# EAGLE design opamp (EAGLE 9.2.2)
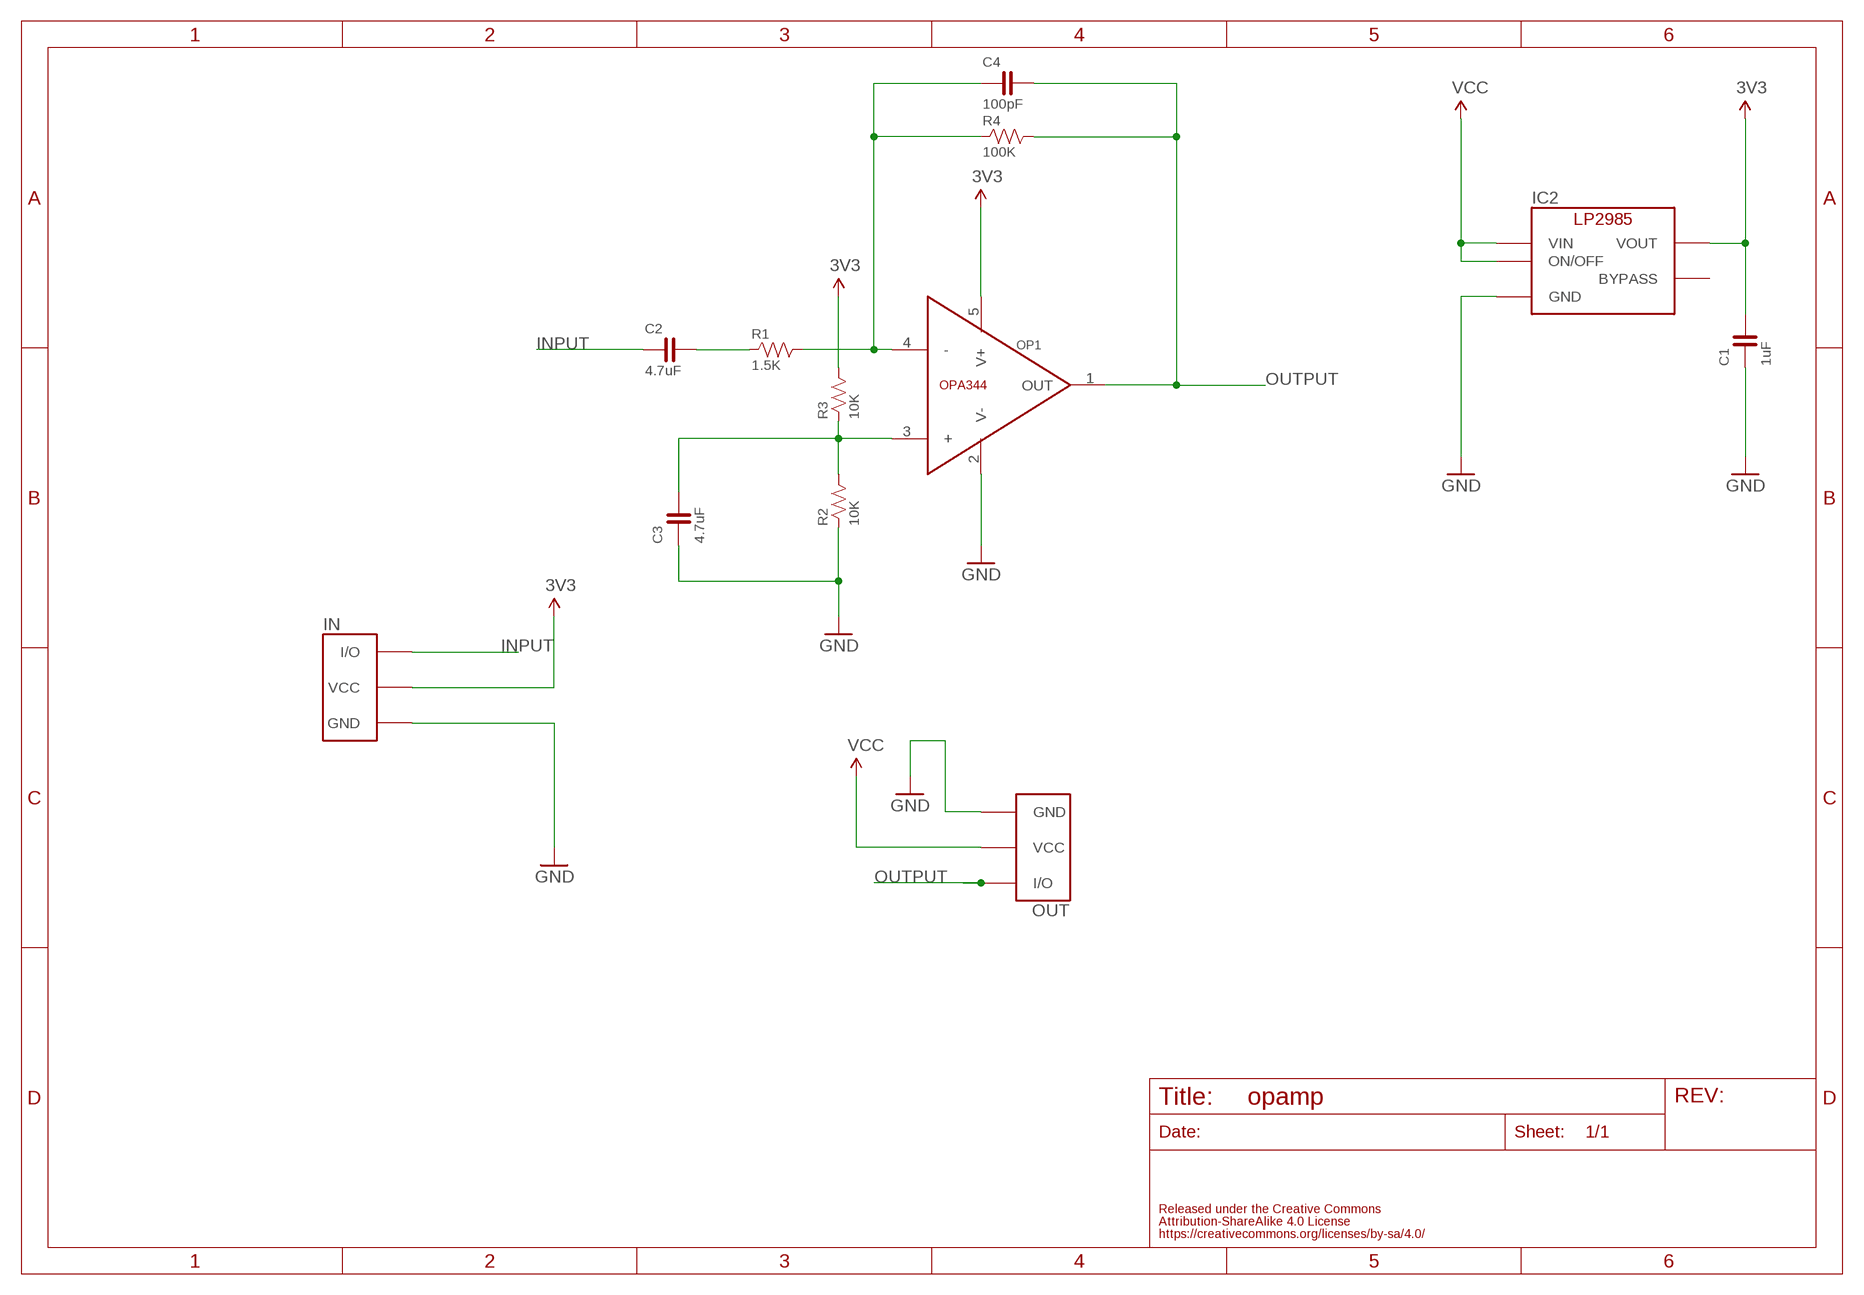
[diagram p0: schematic, sheet 1]

## Parts
C1  1uF  CAPACITOR-0603  [0603]
C2  4.7uF  CAPACITOR-0603  [0603]
C3  4.7uF  CAPACITOR-0603  [0603]
C4  100pF  CAPACITOR-0603  [0603]
IC2  LP2985-33DBV  [SOT-23-5]
IN  FABO_BRICK_3PIN-S03B-PASK-2  [FABO_BRICK_3PIN_S03B-PASK-2]
OP1  OPA344  [SOT23-5]
OUT  FABO_BRICK_3PIN-S03B-PASK-2  [FABO_BRICK_3PIN_S03B-PASK-2]
R1  1.5K  RESISTOR-0603  [0603]
R2  10K  RESISTOR-0603  [0603]
R3  10K  RESISTOR-0603  [0603]
R4  100K  RESISTOR-0603  [0603]

## Nets
3V3: C1.2 IC2.5(VOUT) IN.VCC OP1.5(V+) R3.2
GND: C1.1 C3.1 IC2.2(GND) IN.GND OP1.2(V-) OUT.GND R2.1
INPUT: C2.1 IN.I/O
N$1: C2.2 R1.1
N$3: C3.2 OP1.3(+) R2.2 R3.1
N$5: C4.1 OP1.4(-) R1.2 R4.1
OUTPUT: C4.2 OP1.1(OUT) OUT.I/O R4.2
VCC: IC2.1(VIN) IC2.3(ON/OFF) OUT.VCC
Unconnected: IC2.4(BYPASS)

## Library data of the parts
C1-C4 = FaBo-Capacitor:CAPACITOR: CAPACITOR
IC2 = FaBo-Supply:LP2985: LP2985
IN OUT = FaBo-Template:FABO_BRICK_3PIN: FaBo Brick 3pin
OP1 = FaBo-Opamp:OPA344
R1-R4 = FaBo-Resistors:RESISTOR: RESISTOR

## Board
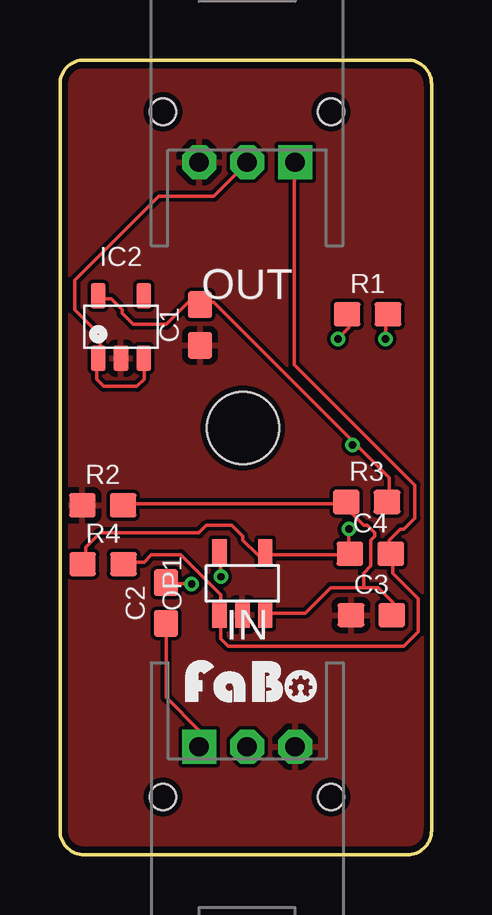
[diagram p1: board, top side]
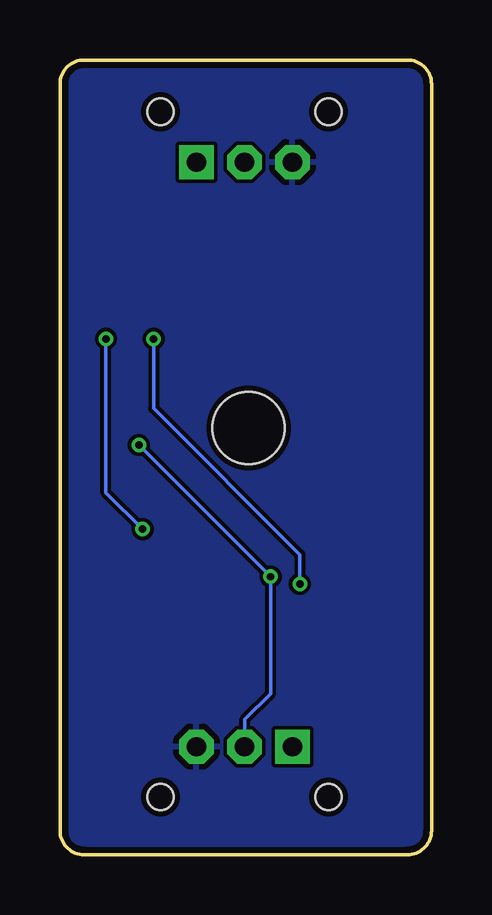
[diagram p2: board, bottom side, seen from below]

Size 15.48 x 33.11 mm. Coordinates in mm from the lower left corner, seen from the top.
Outline: 15.48,32.11 15.48,1 arc-90 14.48,0 1,0 arc-90 0,1 0,32.11 arc-90 1,33.11 14.48,33.11 arc-90 15.48,32.11
Copper layers (1*16): Top 0.035mm / dielectric 1.5mm / Bottom 0.035mm
Design rules "SeeedStudio_2layer_DRU_no_angle_20140221": minimum track width 6mil, minimum drill 12mil, track to track 6mil, track to pad 6mil, pad to pad 6mil, via to via 6mil, smd to smd 0mil, copper to edge 10mil, drill to drill 10mil, minimum pad ring 10mil, minimum via ring 6mil, stop-mask expansion 2mil, vias tented up to drill 100mil, thermal gap 10mil
Holes 3 mm at 7.62,17.78

### Footprints (pad centres in the part's own frame; a part is rotated, then mirrored left to right if it is on the bottom)
0603 = smd 1.1 x 1: 1 -0.85,0; 2 0.85,0
SOT-23-5 = smd 0.6 x 1.05: 1 -0.95,-1.3; 2 0,-1.3; 3 0.95,-1.3; 4 0.95,1.3; 5 -0.95,1.3
FABO_BRICK_3PIN_S03B-PASK-2 = drill 0.8 pad 1.422 octagon: GND -2,0; VCC 0,0 | drill 0.8 pad 1.422 square: I/O 2,0 | hole 1.1: 3.5,2.1; -3.5,2.1
SOT23-5 = smd 0.6 x 1.1: 1 -0.95,-1.3; 2 0,-1.3; 3 0.95,-1.3; 4 0.95,1.3; 5 -0.95,1.3

### Placement (x,y rotation side)
C1  5.83,22.07 90 top
C2  4.42,10.48 90 top
C3  12.97,9.98 0 top
C4  12.93,12.54 0 top
IC2  2.54,21.99 0 top
IN  7.79,4.5 180 top
OP1  7.6,11.3 0 top
OUT  7.79,28.86 0 top
R1  12.81,22.52 0 top
R2  1.78,14.56 0 top
R3  12.78,14.69 0 top
R4  1.79,12.11 0 top
U$2  [LOGO_FABO_S]  8.03,6.2 0 top

### Tracks (layer width: path | path; a pad name or v marks a point on that pad's centre or on a via)
3V3  (via drill 0.3)
  Top 0.152: v6.71,11.58 6.71,12.5 OP1.5 | IC2.5 1.68,23.16 2.13,23.16 2.59,22.71 2.59,22.55 3.05,22.1 4.42,22.1 5.33,23.01 5.79,23.01 C1.2 5.94,23.01 6.4,23.01 12.19,17.22 | 12.19,17.22 13.72,15.7 13.72,14.78 R3.2 | 12.19,17.22 v12.19,17.07
  Bottom 0.152: IN.VCC 7.77,4.57 7.77,5.64 6.71,6.71 v6.71,11.58 v12.19,17.07
GND
  pour Top: 0,0 16.51,0 16.51,33.02 0,33.02
  pour Bottom: 0,0 16.51,0 16.51,33.02 0,33.02
INPUT
  Top 0.152: C2.1 4.42,9.6 4.42,6.55 5.79,5.18 5.79,4.57 IN.I/O
N$1  (via drill 0.3)
  Top 0.152: v5.49,11.28 4.57,11.28 C2.2 | v11.58,21.49 12.04,21.95 12.04,22.4 R1.1
  Bottom 0.152: v5.49,11.28 5.49,12.5 11.58,18.59 v11.58,21.49
N$3
  Top 0.152: 12.65,11.12 13.26,11.12 13.87,10.52 13.87,10.06 C3.2 | 12.65,11.12 11.28,11.12 10.21,10.06 8.69,10.06 OP1.3 | 11.73,14.63 11.89,14.63 R3.1 11.73,14.63 | 11.73,14.63 2.74,14.63 R2.2 | 12.65,11.12 12.65,11.73 12.95,12.04 12.95,13.11 13.11,13.26 13.11,13.41 12.8,13.72 12.65,13.72 11.73,14.63
N$5  (via drill 0.3)
  Top 0.152: R4.1 1.07,12.19 1.07,12.8 1.68,13.41 5.79,13.41 6.1,13.72 7.16,13.72 7.62,13.26 7.62,13.11 8.23,12.5 8.53,12.5 OP1.4 8.69,12.5 12.04,12.5 C4.1 12.04,12.65 v12.04,13.56 | v13.56,21.49 13.56,22.4 R1.2
  Bottom 0.152: v13.56,21.49 13.56,15.09 v12.04,13.56
OUTPUT
  Top 0.152: R4.2 2.74,12.19 3.5,12.19 3.81,12.5 5.03,12.5 6.71,10.82 6.71,10.06 OP1.1 6.71,9.91 6.71,8.99 7.01,8.69 14.33,8.69 14.94,9.3 14.94,10.67 13.87,11.73 13.87,12.5 C4.2 13.72,12.65 13.72,13.11 14.17,13.56 14.33,13.56 14.78,14.02 14.78,15.39 9.75,20.42 9.75,28.8 OUT.I/O
VCC
  Top 0.152: IC2.3 3.5,20.57 3.5,19.81 3.2,19.51 1.83,19.51 1.52,19.81 1.52,20.57 IC2.1 1.68,20.73 1.68,21.64 0.61,22.71 0.61,23.93 4.12,27.43 6.4,27.43 7.77,28.8 OUT.VCC